# Altium schematic sheet Core.SchDoc
size A4; SheetNumber: 1; SheetTotal: 3
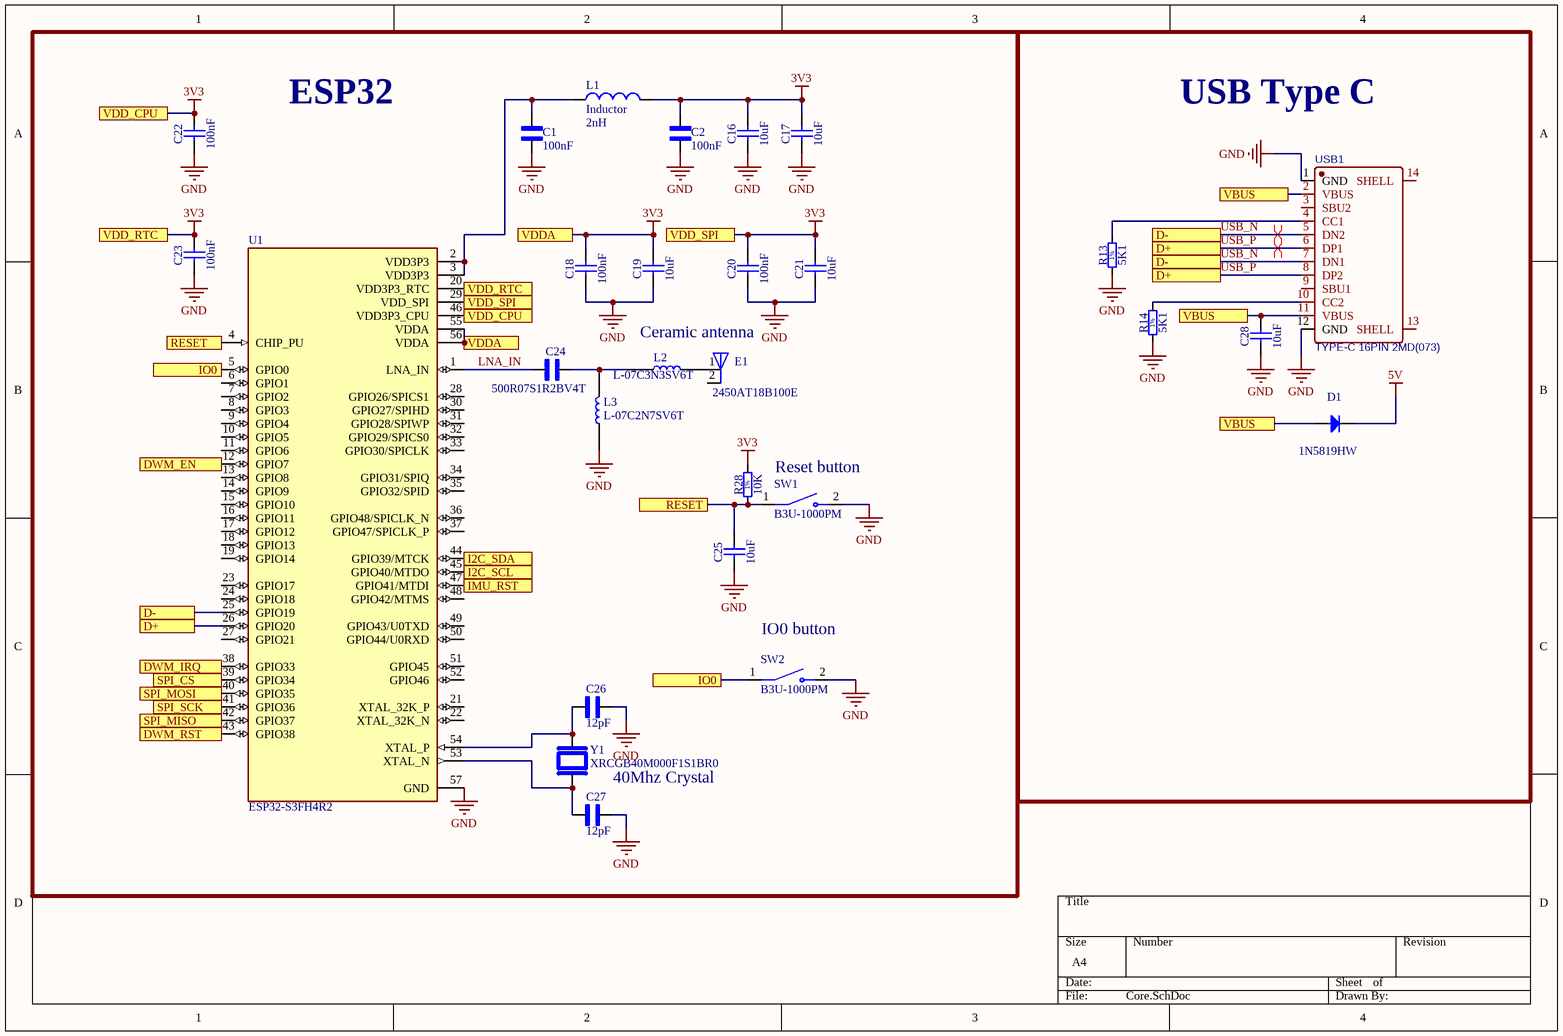
[diagram p0: Core.SchDoc]

## Parts
C1  100nF  [CAPC1005X55N]
C2  100nF  [CAPC1005X55N]
C16  10uF  [0603C]
C17  10uF  [0603C]
C18  100nF  [0603C]
C19  10uF  [0603C]
C20  100nF  [0603C]
C21  10uF  [0603C]
C22  100nF  [0603C]
C23  100nF  [0603C]
C24  500R07S1R2BV4T  [CAPC1005X55N]
C25  10uF  [0603C]
C26  12pF  [CAPC1005X55N]
C27  12pF  [CAPC1005X55N]
C28  10uF  [0603C]
D1  1N5819HW  [SOD-123FL]
E1  2450AT18B100E  [XDCR_2450AT18B100E]
L1  Inductor  value 2nH  [0402-A]
L2  L-07C3N3SV6T  [INDC1005X60N]
L3  L-07C2N7SV6T  [INDC1005X60N]
R13  5K1  [0603R]
R14  5K1  [0603R]
R28  10K  [0603R]
SW1  B3U-1000PM  [SW_B3U-1000PM]
SW2  B3U-1000PM  [SW_B3U-1000PM]
U1  ESP32-S3FH4R2  [QFN40P700X700X90-57N]
USB1  TYPE-C 16PIN 2MD(073)  [USB-C-SMD_TYPE-C-6PIN-2MD-073]
Y1  XRCGB40M000F1S1BR0  [OSC_XRCGB40M000F1S1BR0]

## Blocks framed on the sheet
ESP32: C1 C2 C16-C27 E1 L1-L3 R28 SW1 SW2 U1 Y1
USB Type C: C28 D1 R13 R14 USB1

## Ports
D+, D-, DWM_EN, DWM_IRQ, DWM_RST, I2C_SCL, I2C_SDA, IMU_RST, IO0, RESET, SPI_CS, SPI_MISO, SPI_MOSI, SPI_SCK, VBUS, VDD_CPU, VDD_RTC, VDD_SPI, VDDA

## Nets
3V3: C2.2 C16.2 C17.2 C18.2 C19.2 C20.2 C21.2 C22.2 C23.2 L1.2 R28.2 U1.20(VDD3P3_RTC) U1.29(VDD_SPI) U1.46(VDD3P3_CPU) U1.55(VDDA) U1.56(VDDA) ; port VDDA, port VDD_CPU, port VDD_SPI, port VDD_RTC
5V: D1.1(C)
GND: C1.1 C2.1 C16.1 C17.1 C18.1 C19.1 C20.1 C21.1 C22.1 C23.1 C25.1 C26.2 C27.2 C28.1 L3.1 R13.1 R14.1 SW1.2 SW2.2 U1.57(GND) USB1.1(GND) USB1.12(GND)
DWM_EN: U1.12(GPIO7) ; port DWM_EN
DWM_IRQ: U1.38(GPIO33) ; port DWM_IRQ
DWM_RST: U1.43(GPIO38) ; port DWM_RST
I2C_SCL: U1.45(GPIO40/MTDO) ; port I2C_SCL
I2C_SDA: U1.44(GPIO39/MTCK) ; port I2C_SDA
IMU_RST: U1.47(GPIO41/MTDI) ; port IMU_RST
IO0: SW2.1 U1.5(GPIO0) ; port IO0
LNA_IN: C24.1 U1.1(LNA_IN)
RESET: C25.2 R28.1 SW1.1 U1.4(CHIP_PU) ; port RESET
SPI_CS: U1.39(GPIO34) ; port SPI_CS
SPI_MISO: U1.42(GPIO37) ; port SPI_MISO
SPI_MOSI: U1.40(GPIO35) ; port SPI_MOSI
SPI_SCK: U1.41(GPIO36) ; port SPI_SCK
USB_N: U1.25(GPIO19) USB1.5(DN2) USB1.7(DN1) ; port D-
USB_P: U1.26(GPIO20) USB1.6(DP1) USB1.8(DP2) ; port D+
VBUS: C28.2 D1.2(A) USB1.2(VBUS) USB1.11(VBUS) ; port VBUS
NetC1_2: C1.2 L1.1 U1.2(VDD3P3) U1.3(VDD3P3)
NetC24_2: C24.2 L2.1 L3.2
NetC26_1: C26.1 U1.54(XTAL_P) Y1.1
NetC27_1: C27.1 U1.53(XTAL_N) Y1.3
NetE1_1: E1.1(FEED) L2.2
NetR13_2: R13.2 USB1.4(CC1)
NetR14_2: R14.2 USB1.10(CC2)

Not connected (* = marked no-connect by the designer): E1 2(NC); U1 6(GPIO1) 7(GPIO2) 8(GPIO3) 9(GPIO4) 10(GPIO5) 11(GPIO6) 13(GPIO8) 14(GPIO9) 15(GPIO10) 16(GPIO11) 17(GPIO12) 18(GPIO13) 19(GPIO14) 21(XTAL_32K_P) 22(XTAL_32K_N) 23(GPIO17) 24(GPIO18) 27(GPIO21) 28(GPIO26/SPICS1) 30(GPIO27/SPIHD) 31(GPIO28/SPIWP) 32(GPIO29/SPICS0) 33(GPIO30/SPICLK) 34(GPIO31/SPIQ) 35(GPIO32/SPID) 36(GPIO48/SPICLK_N) 37(GPIO47/SPICLK_P) 48(GPIO42/MTMS) 49(GPIO43/U0TXD) 50(GPIO44/U0RXD) 51(GPIO45) 52(GPIO46); USB1 3(SBU2) 9(SBU1) 13(SHELL) 14(SHELL)

## Layout directives
differential pair: USB_N, USB_P

## Notes on the sheet
- Ceramic antenna
- Reset button
- (near SW2) IO0 button
- 40Mhz Crystal
- (in symbol Resistor - 1%_1) 1%

## Library data of the parts
C1 C2 C26 C27 = 0402N100J500CT: 10 pF Â±5% 50V Ceramic Capacitor C0G, NP0 0402 (1005 Metric); MF: Walsin Technology; SnapEDA_Link: https://www.snapeda.com/parts/0402N100J500CT/Walsin+Technologies/view-part/?ref=snap; Package: 0402 Walsin Technologies; Value: *; MP: 0402N100J500CT; Check_prices: https://www.snapeda.com/parts/0402N100J500CT/Walsin+Technologies/view-part/?ref=eda
C16-C23 C25 C28 = Capacitor - non polarized: Non-polarised capacitor
C24 = 500R07S1R2BV4T: 1.2 pF Â±0.1pF 50V Ceramic Capacitor C0G, NP0 0402 (1005 Metric); MF: Johanson Technology; SnapEDA_Link: https://www.snapeda.com/parts/500R07S1R2BV4T/Johanson/view-part/?ref=snap; Package: 0402 Johanson; Value: *; MP: 500R07S1R2BV4T; Check_prices: https://www.snapeda.com/parts/500R07S1R2BV4T/Johanson/view-part/?ref=eda
D1 = Diode A1C3: Diode Anode Pin 1 Cathode Pin 3 (Pas de pin 2)
E1 = 2450AT18B100E: 2.4GHz - Chip RF Antenna 2.4GHz ~ 2.5GHz 0.5dBi Solder Surface Mount; MF: Johanson Technology; Price: None; Package: None; Purchase-URL: https://pricing.snapeda.com/search/part/2450AT18B100E/?ref=eda; MP: 2450AT18B100E; Availability: In Stock; SnapEDA_Link: https://www.snapeda.com/parts/2450AT18B100E/Johanson+Technology+Inc./view-part/?ref=snap; Check_prices: https://www.snapeda.com/parts/2450AT18B100E/Johanson+Technology+Inc./view-part/?ref=eda; Value: *
L1 = Inductor: Code_IEC: 1005; Published: 8-Jun-2000; LatestRevisionDate: 29-May-2009; LatestRevisionNote: IPC-7351 Footprint Added.; PackageReference: 0402-A; Publisher: Altium Limited; PackageDescription: Chip Inductor; Code_JEITA: 0402
L2 L3 = L-07C3N3SV6T: 3.3 nH Unshielded Multilayer Inductor 300 mA 190mOhm Max 0402 (1005 Metric); MF: Johanson Technology; SnapEDA_Link: https://www.snapeda.com/parts/L-07C3N3SV6T/Johanson/view-part/?ref=snap; Package: SMD-2 JOHANSON; Value: *; MP: L-07C3N3SV6T; Check_prices: https://www.snapeda.com/parts/L-07C3N3SV6T/Johanson/view-part/?ref=eda
R13 R14 R28 = Resistor - 1%_1: Resistor - 1%
SW1 SW2 = B3U-1000PM: Top, w/o Boss 1k Reel | Omron Electronic Components B3U-1000PM; SnapEDA_Link: https://www.snapeda.com/parts/B3U-1000PM/Omron/view-part/?ref=snap; Package: Custom Package Omron; Value: *; MF: Omron; MP: B3U-1000PM; Check_prices: https://www.snapeda.com/parts/B3U-1000PM/Omron/view-part/?ref=eda
U1 = ESP32-S3FH4R2: RF System on a Chip - SoC SMD IC ESP32-S3FH4R2, dual-core MCU, Wi-Fi 2.4G & BLE 5.0 combo, 4 MB flash and 2 MB PSRAM inside, QFN 56-pin, 7*7 mm; MF: Espressif Systems; SnapEDA_Link: https://www.snapeda.com/parts/ESP32-S3FH4R2/Espressif+Systems/view-part/?ref=snap; Package: None; Value: *; MP: ESP32-S3FH4R2; Check_prices: https://www.snapeda.com/parts/ESP32-S3FH4R2/Espressif+Systems/view-part/?ref=eda
USB1 = TYPE-C 16PIN 2MD(073): Manufacturer: SHOU HAN(首韩); Contributor: LCSC; Supplier: LCSC; Supplier Part: C2765186; Manufacturer Part: TYPE-C 16PIN 2MD(073); JLCPCB Part Class: Extended Part; spicePre: U; spiceSymbolName: TYPE-C 16PIN 2MD(073)
Y1 = XRCGB40M000F1S1BR0: Crystal 40MHz Â±10ppm (Tol) Â±10ppm (Stability) 8pF 50Ohm 4-Pin CSMD T/R; MF: Murata Electronics; Purchase-URL: https://pricing.snapeda.com/search/part/XRCGB40M000F1S1BR0/?ref=eda; Package: SMD-4 Murata; Check_prices: https://www.snapeda.com/parts/XRCGB40M000F1S1BR0/Murata/view-part/4980411/?ref=eda; Value: *; SnapEDA_Link: https://www.snapeda.com/parts/XRCGB40M000F1S1BR0/Murata/view-part/4980411/?ref=snap; MP: XRCGB40M000F1S1BR0; Digi-Key_Part_Number: 490-XRCGB40M000F1S1BR0TR-ND